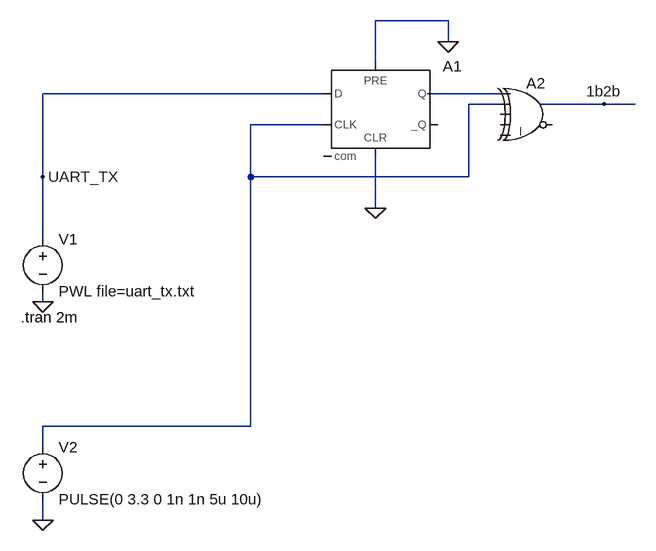
[diagram p0: schematic ManchesterCoding.asc]
ManchesterCoding.asc, the LTspice schematic file:
Version 4
SHEET 1 2296 680
WIRE 592 -192 480 -192
WIRE 592 -160 592 -192
WIRE 480 -128 480 -192
WIRE 400 -80 -32 -80
WIRE 672 -80 560 -80
WIRE 672 -64 624 -64
WIRE 832 -64 736 -64
WIRE 880 -64 832 -64
WIRE 400 -32 288 -32
WIRE -32 48 -32 -80
WIRE 288 48 288 -32
WIRE 624 48 624 -64
WIRE 624 48 288 48
WIRE 480 96 480 16
WIRE -32 144 -32 48
WIRE -32 240 -32 224
WIRE 288 432 288 48
WIRE 288 432 -32 432
WIRE -32 464 -32 432
WIRE -32 576 -32 544
FLAG -32 240 0
FLAG -32 48 UART_TX
FLAG 832 -64 1b2b
FLAG -32 576 0
FLAG 592 -160 0
FLAG 480 96 0
SYMBOL voltage -32 128 R0
WINDOW 123 0 0 Left 0
WINDOW 39 0 0 Left 0
SYMATTR InstName V1
SYMATTR Value PWL file=uart_tx.txt
SYMBOL Digital\\dflop 480 -128 R0
SYMATTR InstName A1
SYMBOL Digital\\xor 720 -112 R0
SYMATTR InstName A2
SYMBOL voltage -32 448 R0
WINDOW 123 0 0 Left 0
WINDOW 39 0 0 Left 0
SYMATTR InstName V2
SYMATTR Value PULSE(0 3.3 0 1n 1n 5u 10u)
TEXT -66 264 Left 2 !.tran 2m

The netlist it stands for:
* ManchesterCoding.asc
V1 UART_TX 0 PWL file=uart_tx.txt
A1 UART_TX 0 N002 0 0 0 N001 0 DFLOP
A2 N001 N002 0 0 0 0 1b2b 0 XOR
V2 N002 0 PULSE(0 3.3 0 1n 1n 5u 10u)
.tran 2m
.backanno
.end